# Altium schematic sheet CPULED.SchDoc
size A
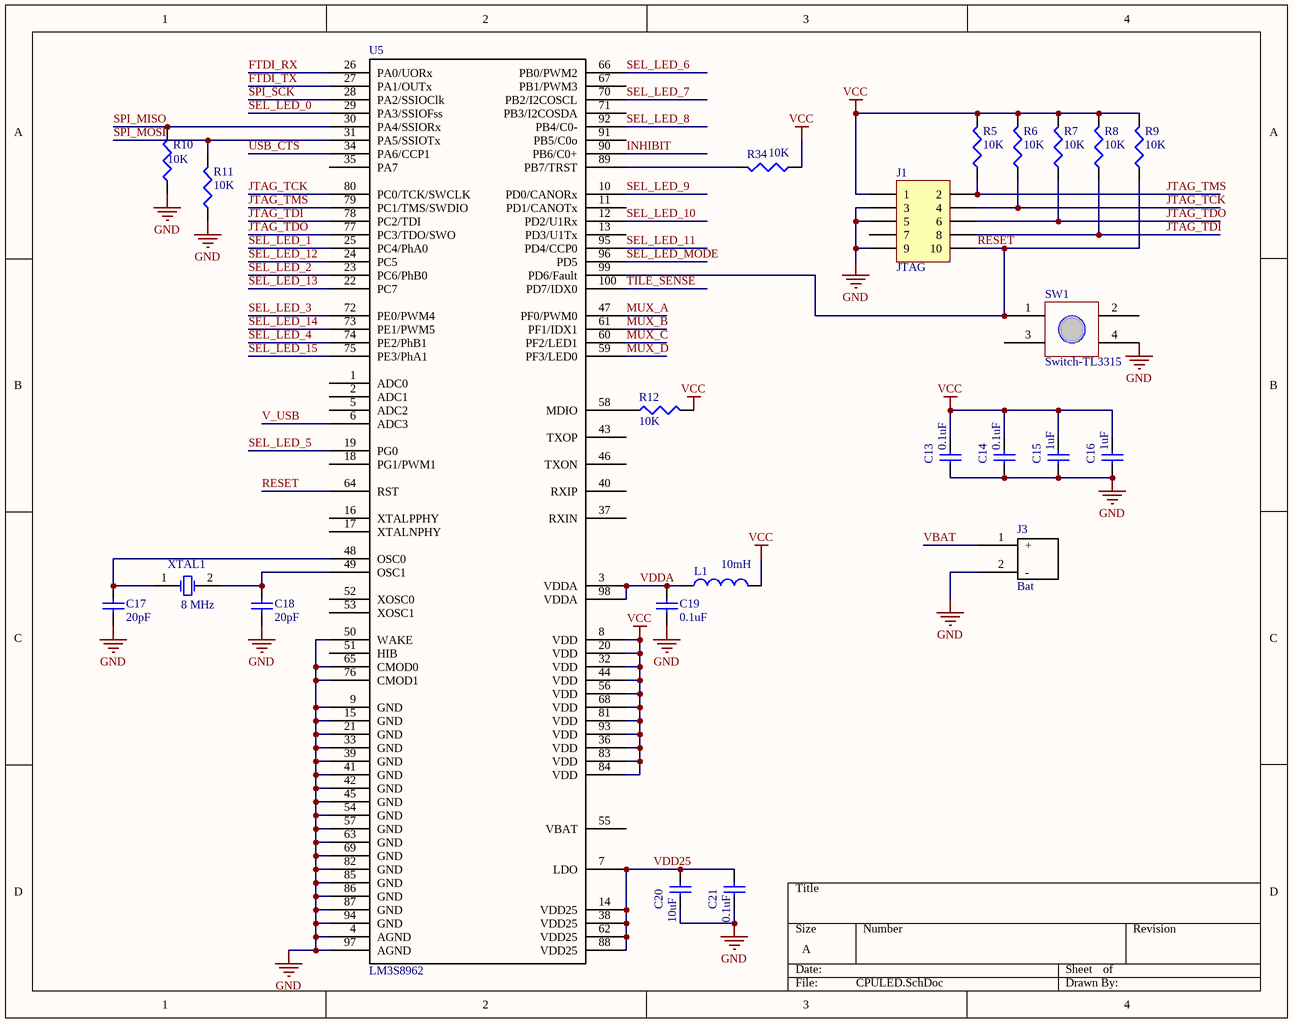
[diagram p0: CPULED.SchDoc]

## Parts
C13  value 0.1uF  [CAPC1005L]  (hidden comment: Cap Semi)
C14  value 0.1uF  [CAPC1005L]  (hidden comment: Cap Semi)
C15  value 1uF  [CAPC1608L]  (hidden comment: Cap Semi)
C16  value 1uF  [CAPC1608L]  (hidden comment: Cap Semi)
C17  value 20pF  [CAPC1005L]  (hidden comment: Cap Semi)
C18  value 20pF  [CAPC1005L]  (hidden comment: Cap Semi)
C19  value 0.1uF  [CAPC1005L]  (hidden comment: Cap Semi)
C20  value 10uF  [CAPC1608L]  (hidden comment: Cap Semi)
C21  value 0.1uF  [CAPC1005L]  (hidden comment: Cap Semi)
J1  JTAG  [JTAG-10]
J3  Bat  [BatteryConnJST]
L1  value 10mH  [INDC2012L]  (hidden comment: Inductor)
R5  value 10K  [RESC1608L]  (hidden comment: Res3)
R6  value 10K  [RESC1608L]  (hidden comment: Res3)
R7  value 10K  [RESC1608L]  (hidden comment: Res3)
R8  value 10K  [RESC1608L]  (hidden comment: Res3)
R9  value 10K  [RESC1608L]  (hidden comment: Res3)
R10  value 10K  [RESC1608L]  (hidden comment: Res3)
R11  value 10K  [RESC1608L]  (hidden comment: Res3)
R12  value 10K  [RESC1608L]  (hidden comment: Res3)
R34  value 10K  [RESC1608L]  (hidden comment: Res3)
SW1  Switch-TL3315  [Switch-TL3315]
U5  LM3S8962  [LQFP-100]
XTAL1  8 MHz  [RESC5025L]

## Nets
GND: C13.1 C14.1 C15.1 C16.1 C17.1 C18.1 C19.1 C20.1 C21.1 J1.3 J1.5 J1.9 J3.2(-) R10.1 R11.1 SW1.4 U5.4(AGND) U5.9(GND) U5.15(GND) U5.21(GND) U5.33(GND) U5.39(GND) U5.41(GND) U5.42(GND) U5.45(GND) U5.50(WAKE) U5.54(GND) U5.57(GND) U5.63(GND) U5.65(CMOD0) U5.69(GND) U5.76(CMOD1) U5.82(GND) U5.85(GND) U5.86(GND) U5.87(GND) U5.94(GND) U5.97(AGND)
VCC: C13.2 C14.2 C15.2 C16.2 J1.1 L1.2 R5.2 R6.2 R7.2 R8.2 R9.2 R12.2 R34.1 U5.8(VDD) U5.20(VDD) U5.32(VDD) U5.36(VDD) U5.44(VDD) U5.56(VDD) U5.68(VDD) U5.81(VDD) U5.83(VDD) U5.84(VDD) U5.93(VDD)
FTDI_RX: U5.26(PA0/UORx)
FTDI_TX: U5.27(PA1/OUTx)
INHIBIT: U5.90(PB6/C0+)
JTAG_TCK: J1.4 R6.1 U5.80(PC0/TCK/SWCLK)
JTAG_TDI: J1.8 R8.1 U5.78(PC2/TDI)
JTAG_TDO: J1.6 R7.1 U5.77(PC3/TDO/SWO)
JTAG_TMS: J1.2 R5.1 U5.79(PC1/TMS/SWDIO)
MUX_A: U5.47(PF0/PWM0)
MUX_B: U5.61(PF1/IDX1)
MUX_C: U5.60(PF2/LED1)
MUX_D: U5.59(PF3/LED0)
RESET: J1.10 R9.1 SW1.1 U5.64(RST) U5.99(PD6/Fault)
SEL_LED_0: U5.29(PA3/SSIOFss)
SEL_LED_1: U5.25(PC4/PhA0)
SEL_LED_2: U5.23(PC6/PhB0)
SEL_LED_3: U5.72(PE0/PWM4)
SEL_LED_4: U5.74(PE2/PhB1)
SEL_LED_5: U5.19(PG0)
SEL_LED_6: U5.66(PB0/PWM2)
SEL_LED_7: U5.70(PB2/I2COSCL)
SEL_LED_8: U5.92(PB4/C0-)
SEL_LED_9: U5.10(PD0/CANORx)
SEL_LED_10: U5.12(PD2/U1Rx)
SEL_LED_11: U5.95(PD4/CCP0)
SEL_LED_12: U5.24(PC5)
SEL_LED_13: U5.22(PC7)
SEL_LED_14: U5.73(PE1/PWM5)
SEL_LED_15: U5.75(PE3/PhA1)
SEL_LED_MODE: U5.96(PD5)
SPI_MISO: R10.2 U5.30(PA4/SSIORx)
SPI_MOSI: R11.2 U5.31(PA5/SSIOTx)
SPI_SCK: U5.28(PA2/SSIOClk)
TILE_SENSE: U5.100(PD7/IDX0)
USB_CTS: U5.34(PA6/CCP1)
V_USB: U5.6(ADC3)
VBAT: J3.1(+)
VDD25: C20.2 C21.2 U5.7(LDO) U5.14(VDD25) U5.38(VDD25) U5.62(VDD25) U5.88(VDD25)
VDDA: C19.2 L1.1 U5.3(VDDA) U5.98(VDDA)
NetC17_2: C17.2 U5.48(OSC0) XTAL1.1(OSC1)
NetC18_2: C18.2 U5.49(OSC1) XTAL1.2(OSC2)
NetR12_1: R12.1 U5.58(MDIO)
NetR34_2: R34.2 U5.89(PB7/TRST)

Not connected (* = marked no-connect by the designer): J1 7; SW1 2 3; U5 1(ADC0) 2(ADC1) 5(ADC2) 11(PD1/CANOTx) 13(PD3/U1Tx) 16(XTALPPHY) 17(XTALNPHY) 18(PG1/PWM1) 35(PA7) 37(RXIN) 40(RXIP) 43(TXOP) 46(TXON) 51(HIB) 52(XOSC0) 53(XOSC1) 55(VBAT) 67(PB1/PWM3) 71(PB3/I2COSDA) 91(PB5/C0o)

## Library data of the parts
C13-C21 = Cap Semi: Capacitor (Semiconductor SIM Model); Published: 8-Jun-2000; LatestRevisionDate: 29-May-2009; LatestRevisionNote: IPC-7351 Footprint Added.; PackageReference: C1206; Publisher: Altium Limited; PackageDescription: Chip Capacitor
J1 = Header 5X2H: Header, 5-Pin, Dual row, Right Angle; LatestRevisionDate: 17-Jul-2002; LatestRevisionNote: Re-released for DXP Platform.; Publisher: Altium Limited
J3 = BatteryConnJST
L1 = Inductor: Code_IEC: 1005; Published: 8-Jun-2000; LatestRevisionDate: 29-May-2009; LatestRevisionNote: IPC-7351 Footprint Added.; PackageReference: 0402-A; Publisher: Altium Limited; PackageDescription: Chip Inductor; Code_JEITA: 0402
R5-R12 R34 = Res3: Resistor; Published: 8-Jun-2000; LatestRevisionDate: 29-May-2009; LatestRevisionNote: IPC-7351 Footprint Added.; PackageReference: J1-0603; Publisher: Altium Limited; PackageDescription: Chip Resistor
XTAL1 = XTAL: Crystal Oscillator; Published: 8-Jun-2000; LatestRevisionDate: 17-Jul-2002; LatestRevisionNote: Re-released for DXP Platform.; PackageReference: R38; Publisher: Altium Limited